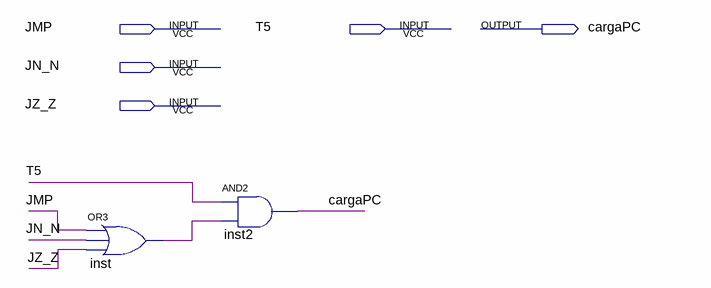
[diagram p0: schematic sheet]
// Quartus schematic cargaPC.bdf as structural Verilog: 2 symbols, 5 pins
module cargaPC (
  input  JMP,
  input  T5,
  input  JN_N,
  input  JZ_Z,
  output cargaPC
);

  wire inst_out;

  or inst (inst_out, JMP, JN_N, JZ_Z);
  and inst2 (cargaPC, T5, inst_out);
endmodule
